# EasyEDA Pro project ProPrj_IoT Animal Trap_2026-03-28 1.epro, schematic Schematic1
Board Name: Board1; Create Date: 2026-03-20; Page Name: P1; Project Name: IoT Animal Trap; Schematic Name: Schematic1; Update Date: 2026-03-28; Company: EasyEDA.com; Page Size: A4; Version: V1.0
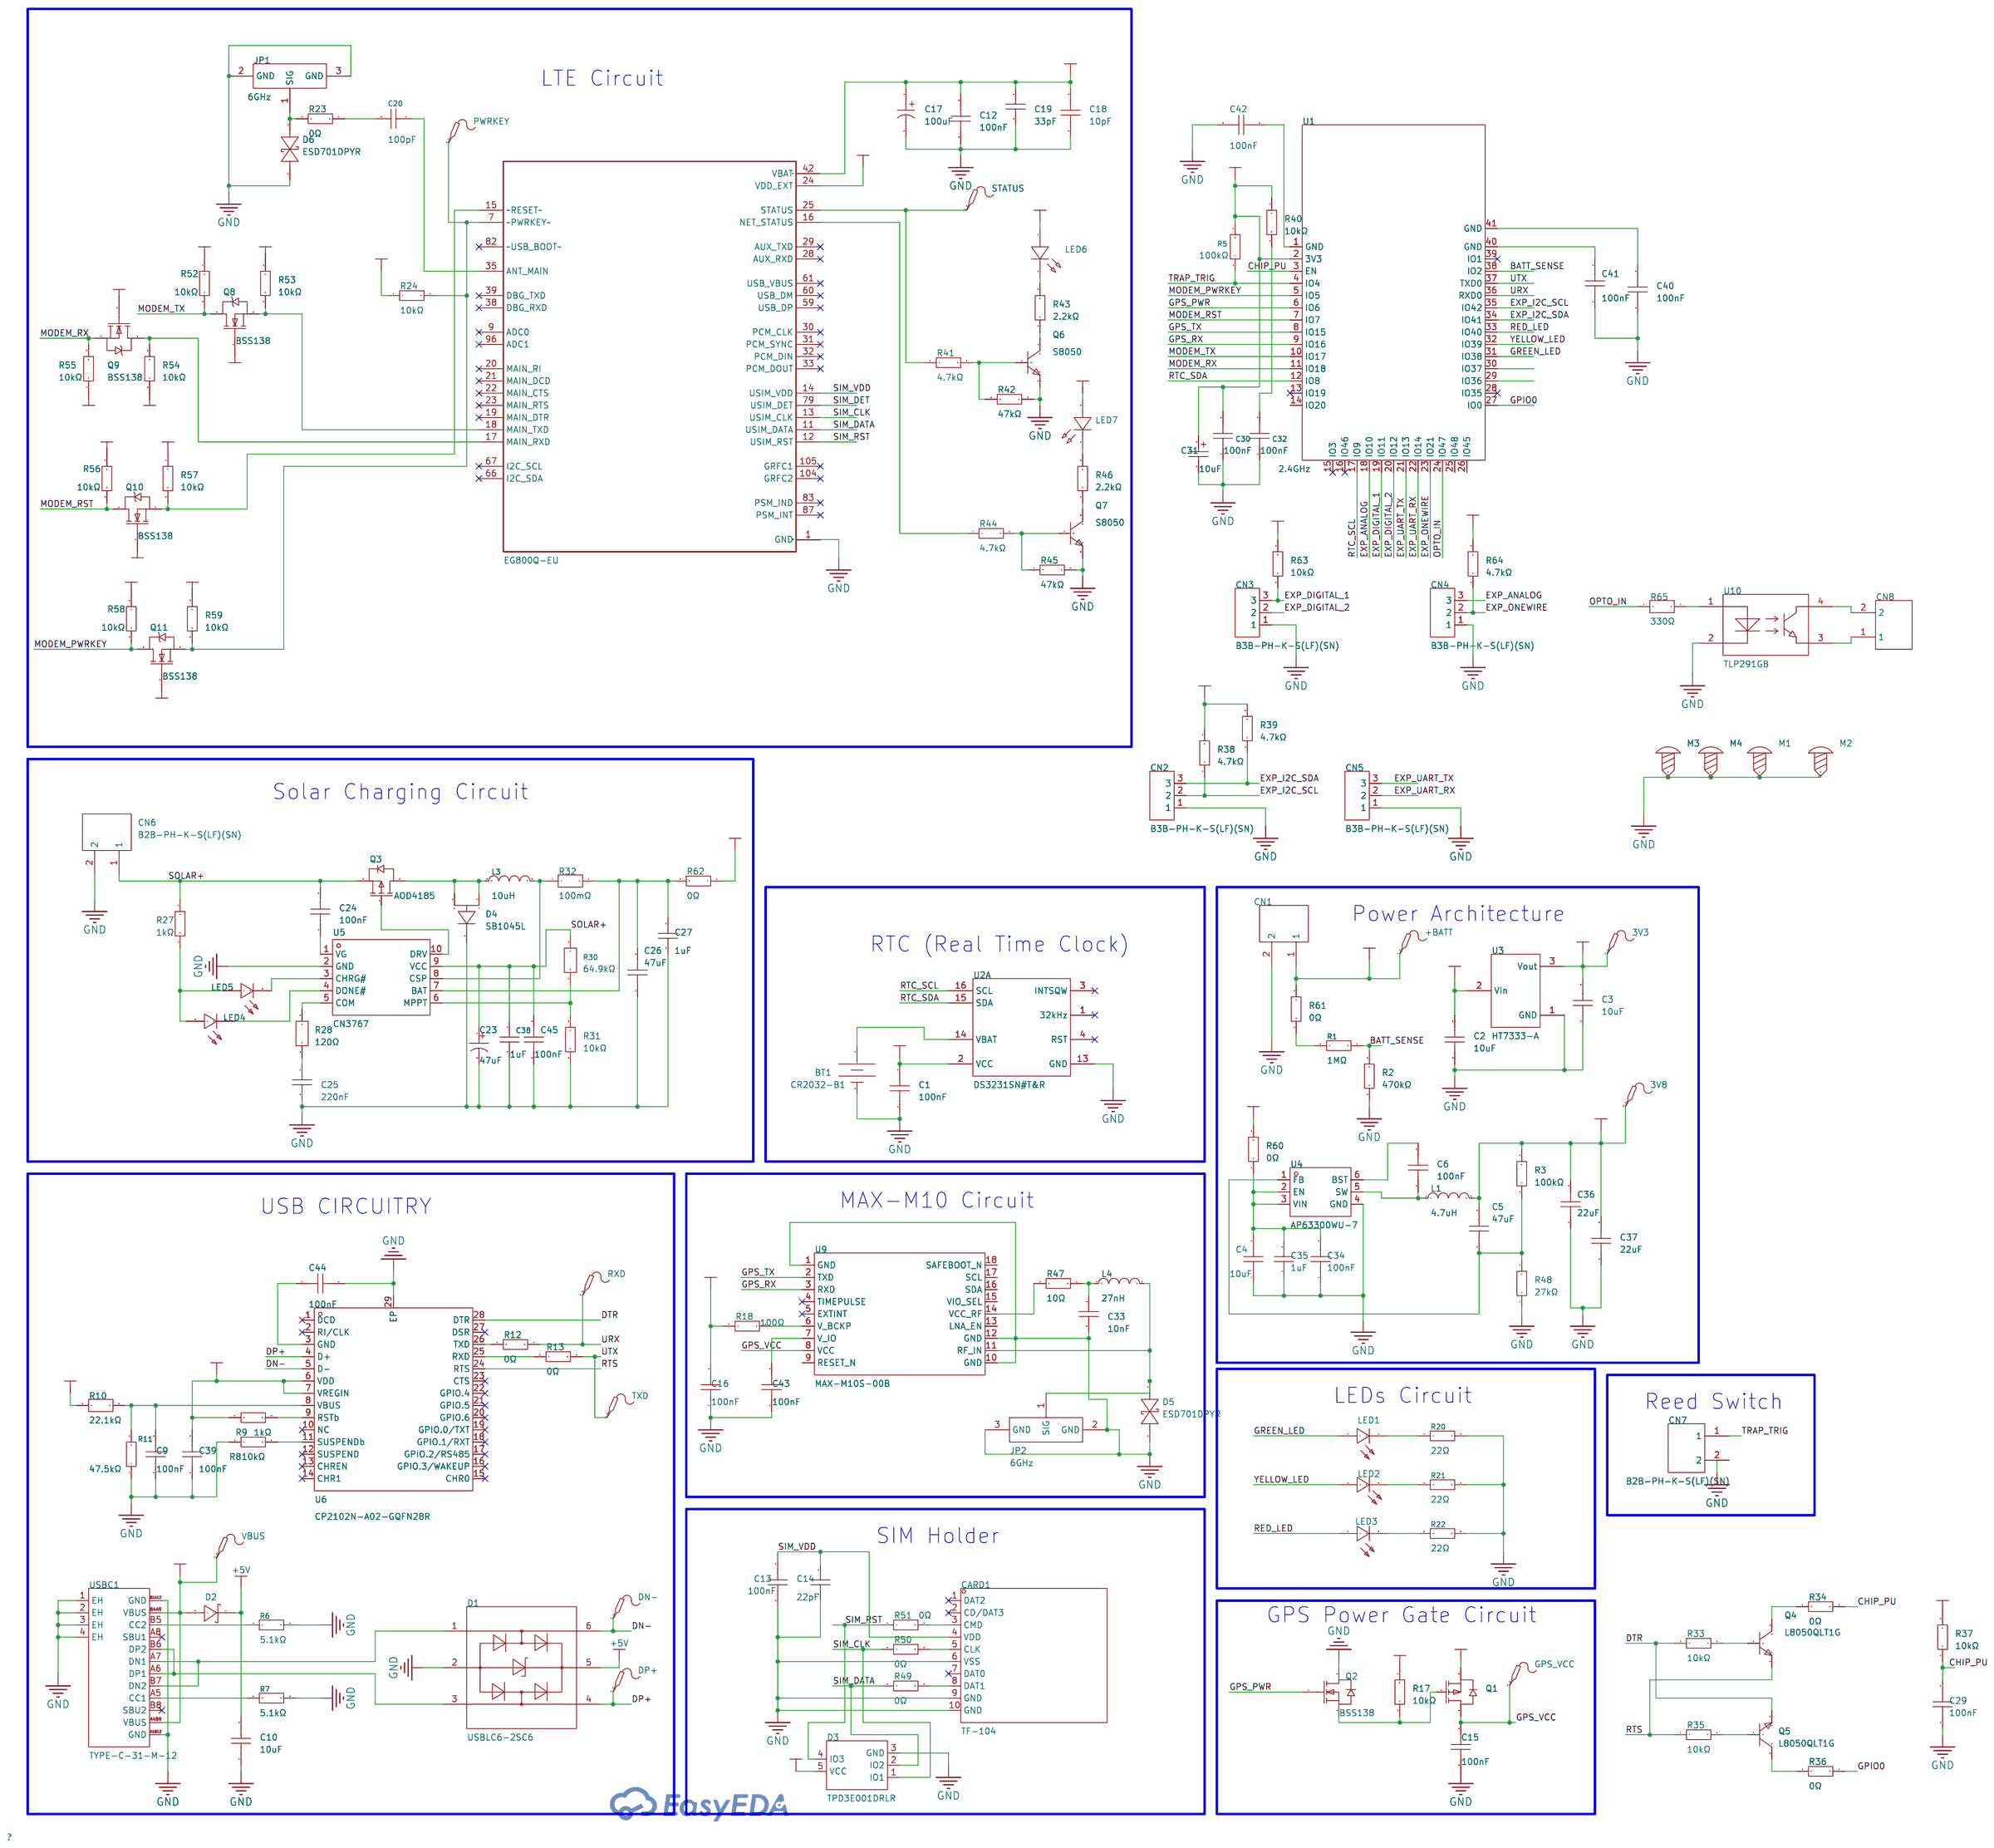
[diagram p0: schematic sheet]

## Parts
3V3  -  [Test-Point-0.5mm]
3V8  -  [Test-Point-0.5mm]
+BATT  -  [Test-Point-0.5mm]
BT1  CR2032-B1  [BAT-SMD_CR2032-B1]
C1  100nF  [C0402]
C2  10uF  [C0805]
C3  10uF  [C0805]
C4  10uF  [C0805]
C5  47uF  [C0805]
C6  100nF  [C0402]
C9  100nF  [C0402]
C10  10uF  [C0805]
C12  100nF  [C0402]
C13  100nF  [C0402]
C14  22pF  [C0402]
C15  100nF  [C0402]
C16  100nF  [C0402]
C17  100uF  [CAP-SMD_BD6.3-L6.6-W6.6-LS7.2-FD]
C18  10pF  [C0402]
C19  33pF  [C0402]
C20  100pF  [C0402]
C23  47uF  [CAP-SMD_BD6.3-L6.6-W6.6-FD]
C24  100nF  [C0402]
C25  220nF  [C0402]
C26  47uF  [C0805]
C27  1uF  [C0402]
C29  100nF  [C0402]
C30  100nF  [C0402]
C31  10uF  [CASE-B_3528]
C32  100nF  [C0402]
C33  10nF  [C0402]
C34  100nF  [C0402]
C35  1uF  [C0402]
C36  22uF  [C0402]
C37  22uF  [C0402]
C38  1uF  [C0402]
C39  100nF  [C0402]
C40  100nF  [C0402]
C41  100nF  [C0402]
C42  100nF  [C0402]
C43  100nF  [C0402]
C44  100nF  [C0402]
C45  100nF  [C0402]
CARD1  TF-104  [TF-SMD_TF-104]
CN1  B2B-PH-K-S(LF)(SN)  [CONN-TH_B2B-PH-K-S]
CN2  B3B-PH-K-S(LF)(SN)  [CONN-TH_B3B-PH-K-S]  (no BOM)
CN3  B3B-PH-K-S(LF)(SN)  [CONN-TH_B3B-PH-K-S]  (no BOM)
CN4  B3B-PH-K-S(LF)(SN)  [CONN-TH_B3B-PH-K-S]  (no BOM)
CN5  B3B-PH-K-S(LF)(SN)  [CONN-TH_B3B-PH-K-S]  (no BOM)
CN6  B2B-PH-K-S(LF)(SN)  [CONN-TH_B2B-PH-K-S]
CN7  B2B-PH-K-S(LF)(SN)  [CONN-TH_B2B-PH-K-S]  (no BOM)
CN8  B2B-PH-K-S(LF)(SN)  [CONN-TH_B2B-PH-K-S]  (no BOM)
D1  USBLC6-2SC6  [SOT-23-6_L2.9-W1.6-P0.95-LS2.8-BL]
D2  1N5819HW-7-F  [SOD-123_L2.7-W1.6-LS3.7-RD]
D3  TPD3E001DRLR  [SOT-553-5_L1.6-W1.2-P0.50-LS1.6-TL]
D4  SB1045L  [TO-277_3P-L5.4-W4.0-LS6.5-TR]
D5  ESD701DPYR  [X1SON-2_L1.0-W0.6-P0.65-BI]
D6  ESD701DPYR  [X1SON-2_L1.0-W0.6-P0.65-BI]
DN-  -  [Test-Point-0.5mm]
DP+  -  [Test-Point-0.5mm]
GPS_VCC  -  [Test-Point-0.5mm]
JP1  6GHz  [RF-SMD_FRF05002-JSS103M]
JP2  6GHz  [RF-SMD_FRF05002-JSS103M]
L1  4.7uH  [IND-SMD_L5.0-W5.0]
L3  10uH  [IND-SMD_L5.2-W5.2_MCW-0530]
L4  27nH  [L0402-RD]
LED1  19-217/GHC-YR1S2/3T  [LED0603-RD]
LED2  19-217/BHC-ZL1M2RY/3T  [LED0603-FD_BLUE]
LED3  17-21SURC/S530-A3/TR8  [LED0805-R-RD]
LED4  19-217/GHC-YR1S2/3T  [LED0603-RD]
LED5  17-21SURC/S530-A3/TR8  [LED0805-R-RD]
LED6  SML-D12P8WT86C  [LED0603-FD_GREEN]
LED7  YLED0603Y  [LED0603-RD-1]
M1  -  [Screw-Hole-M3]
M2  -  [Screw-Hole-M3]
M3  -  [Screw-Hole-M3]
M4  -  [Screw-Hole-M3]
PWRKEY  -  [Test-Point-0.5mm]
Q1  SI2301CDS-T1-GE3  [SOT-23-3_L3.0-W1.7-P0.95-LS2.9-BR]
Q2  BSS138  [SOT-23-3_L2.9-W1.3-P1.90-LS2.4-BR_1]
Q3  AOD4185  [TO-252-3_L6.6-W6.1-P4.57-LS9.9-BR-CW]
Q4  L8050QLT1G  [SOT-23-3_L2.9-W1.3-P1.90-LS2.4-BR]
Q5  L8050QLT1G  [SOT-23-3_L2.9-W1.3-P1.90-LS2.4-BR]
Q6  S8050  [SOT-23-3_L2.9-W1.3-P1.90-LS2.4-BR]
Q7  S8050  [SOT-23-3_L2.9-W1.3-P1.90-LS2.4-BR]
Q8  BSS138  [SOT-23-3_L2.9-W1.6-P1.90-LS2.8-BR]
Q9  BSS138  [SOT-23-3_L2.9-W1.6-P1.90-LS2.8-BR]
Q10  BSS138  [SOT-23-3_L2.9-W1.6-P1.90-LS2.8-BR]
Q11  BSS138  [SOT-23-3_L2.9-W1.6-P1.90-LS2.8-BR]
R1  1MΩ  [R0402]
R2  470kΩ  [R0402]
R3  100kΩ  [R0603]
R5  100kΩ  [R0402]
R6  5.1kΩ  [R0402]
R7  5.1kΩ  [R0402]
R8  10kΩ  [R0402]
R9  1kΩ  [R0402]
R10  22.1kΩ  [R0402]
R11  47.5kΩ  [R0402]
R12  0Ω  [R0402]
R13  0Ω  [R0402]
R17  10kΩ  [R0402]
R18  100Ω  [R0402]
R20  22Ω  [R0402]
R21  22Ω  [R0402]
R22  22Ω  [R0402]
R23  0Ω  [R0402]
R24  10kΩ  [R0402]
R27  1kΩ  [R0402]
R28  120Ω  [R0402]
R30  64.9kΩ  [R0402]
R31  10kΩ  [R0402]
R32  100mΩ  [R0402]
R33  10kΩ  [R0402]
R34  0Ω  [R0402]
R35  10kΩ  [R0402]
R36  0Ω  [R0402]
R37  10kΩ  [R0402]
R38  4.7kΩ  [R0402]
R39  4.7kΩ  [R0402]
R40  10kΩ  [R0402]
R41  4.7kΩ  [R0402]
R42  47kΩ  [R0402]
R43  2.2kΩ  [R0402]
R44  4.7kΩ  [R0402]
R45  47kΩ  [R0402]
R46  2.2kΩ  [R0402]
R47  10Ω  [R0402]
R48  27kΩ  [R0603]
R49  0Ω  [R0402]
R50  0Ω  [R0402]
R51  0Ω  [R0402]
R52  10kΩ  [R0402]
R53  10kΩ  [R0402]
R54  10kΩ  [R0402]
R55  10kΩ  [R0402]
R56  10kΩ  [R0402]
R57  10kΩ  [R0402]
R58  10kΩ  [R0402]
R59  10kΩ  [R0402]
R60  0Ω  [R0402]
R61  0Ω  [R0402]
R62  0Ω  [R0402]
R63  10kΩ  [R0402]
R64  4.7kΩ  [R0402]
R65  330Ω  [R0402]
RXD  -  [SMD-1_BD1.5]
STATUS  -  [Test-Point-0.5mm]
TXD  -  [SMD-1_BD1.5]
U1  2.4GHz  [WIRELM-SMD_ESP32-S3-WROOM-1]
U2  DS3231SN#T&R  [SOIC-16_L10.3-W7.5-P1.27-LS10.3-BL]  (section 1)
U3  HT7333-A  [SOT-89-3_L4.5-W2.5-P1.50-LS4.2-BR]
U4  AP63300WU-7  [TSOT-23-6_L2.9-W1.6-P0.95-LS2.8-BR]
U5  CN3767  [SSOP-10_L4.9-W3.9-P1.00-LS6.0-BL]
U6  CP2102N-A02-GQFN28R  [QFN-28_L5.0-W5.0-P0.50-TL-EP3.3]
U7  EG800Q-EU  [XCVR_EG800Q-EU]  (section 1)
U9  MAX-M10S-00B  [SMD-18_L10.1-W9.7-P1.10-TL_SKG09F]
U10  TLP291GB  [SO-4_L4.6-W2.6-P1.27-LS7.0]
USBC1  TYPE-C-31-M-12  [USB-C_SMD-TYPE-C-31-M-12_1]
VBUS  -  [Test-Point-0.5mm]

## Library data of the parts
3V3 3V8 +BATT DN- DP+ GPS_VCC PWRKEY RXD STATUS TXD VBUS = Test-Point: Test Point 测试点
BT1 = CR2032-B1: Supplier Part: F; Manufacturer: HanElectricity(瀚源); Supplier Footprint: SMD; JLCPCB Part Class: Extended Part; Datasheet: https://item.szlcsc.com/datasheet/CR2032-B1/50871509.html; Supplier: LCSC
C1 C6 C9 C12 C13 C15 C16 C24 C29 C34 C39-C45 = CL05B104KO5NNNC: Capacitance:100nF Tolerance:±10% Tolerance:±10% Voltage Rating:16V Temperature Coefficient:X7R; LCSC Part Name: 100nF ±10% 16V; Supplier Part: C1525; Manufacturer: SAMSUNG(三星); Supplier Footprint: 0402; JLCPCB Part Class: Basic Part; Datasheet: https://item.szlcsc.com/datasheet/CL05B104KO5NNNC/1877.html; Supplier: LCSC; Tolerance: ±10%; Voltage Rating: 16V; Temperature Coefficient: X7R
C2-C4 C10 = CL21A106KAYNNNE_C15850: Capacitance:10uF Tolerance:±10% Tolerance:±10% Voltage Rating:25V Temperature Coefficient:X5R; LCSC Part Name: 10uF ±10% 25V; Supplier Part: C15850; Manufacturer: SAMSUNG(三星); Manufacturer Part: CL21A106KAYNNNE; Supplier Footprint: 0805; JLCPCB Part Class: Basic Part; Datasheet: https://item.szlcsc.com/datasheet/CL21A106KAYNNNE/16532.html; Supplier: LCSC; Tolerance: ±10%; Voltage Rating: 25V; Temperature Coefficient: X5R
C5 C26 = GRM21BR61A476ME15L: Capacitance:47uF Tolerance:±20% Tolerance:±20% Voltage Rating:10V Temperature Coefficient:X5R; LCSC Part Name: 47uF ±20% 10V; Supplier Part: C124129; Manufacturer: muRata(村田); Supplier Footprint: 0805; JLCPCB Part Class: Extended Part; Datasheet: https://item.szlcsc.com/datasheet/GRM21BR61A476ME15L/125403.html; Supplier: LCSC; Tolerance: ±20%; Voltage Rating: 10V; Temperature Coefficient: X5R
C14 = 0402CG220J500NT: Capacitance:22pF Tolerance:±5% Tolerance:±5% Voltage Rating:50V Temperature Coefficient:C0G; LCSC Part Name: 22pF ±5% 50V; Supplier Part: C1555; Manufacturer: FH(风华); Supplier Footprint: 0402; JLCPCB Part Class: Basic Part; Datasheet: https://item.szlcsc.com/datasheet/0402CG220J500NT/1907.html; Supplier: LCSC; Tolerance: ±5%; Voltage Rating: 50V; Temperature Coefficient: C0G
C17 = RVT100UF16V67RV0016: Capacitance:100uF Tolerance:±20% Tolerance:±20% Voltage Rating:16V Ripple Current:93mA@120Hz Equivalent Series Resistance(ESR):- Diameter:6.3mm Height - Seated (Max):5.4mm Lifetime:2000hrs@105℃ Operating Temperature:-55℃~+105℃ Operating Temperature:-55℃~+; LCSC Part Name: 100uF ±20% 16V; Supplier Part: C2887276; Manufacturer: KNSCHA(科尼盛); Supplier Footprint: SMD,D6.3xL5.4mm; JLCPCB Part Class: Extended Part; Datasheet: https://item.szlcsc.com/datasheet/RVT100UF16V67RV0016/3103844.html; Supplier: LCSC; Tolerance: ±20%; Voltage Rating: 16V; Ripple Current: 93mA@120Hz; Diameter: 6.3mm; Height - Seated (Max): 5.4mm; Lifetime: 2000hrs@105℃; Operating Temperature: -55℃~+105℃
C18 = CL05C100JB5NNNC: Capacitance:10pF Tolerance:±5% Tolerance:±5% Voltage Rating:50V Temperature Coefficient:C0G; LCSC Part Name: 10pF ±5% 50V; Supplier Part: C32949; Manufacturer: SAMSUNG(三星); Supplier Footprint: 0402; JLCPCB Part Class: Basic Part; Datasheet: https://item.szlcsc.com/datasheet/CL05C100JB5NNNC/33914.html; Supplier: LCSC; Tolerance: ±5%; Voltage Rating: 50V; Temperature Coefficient: C0G
C19 = CL05C330JB5NNNC: Capacitance:33pF Tolerance:±5% Tolerance:±5% Voltage Rating:50V Temperature Coefficient:C0G; LCSC Part Name: 33pF ±5% 50V; Supplier Part: C70465; Manufacturer: SAMSUNG(三星); Supplier Footprint: 0402; JLCPCB Part Class: Extended Part; Datasheet: https://item.szlcsc.com/datasheet/CL05C330JB5NNNC/71562.html; Supplier: LCSC; Tolerance: ±5%; Voltage Rating: 50V; Temperature Coefficient: C0G
C20 = CC0402JRNPO9BN101: Capacitance:100pF Tolerance:±5% Tolerance:±5% Voltage Rating:50V Temperature Coefficient:NP0; LCSC Part Name: 100pF ±5% 50V; Supplier Part: C106200; Manufacturer: YAGEO(国巨); Supplier Footprint: 0402; JLCPCB Part Class: Extended Part; Datasheet: https://item.szlcsc.com/datasheet/CC0402JRNPO9BN101/107415.html; Supplier: LCSC; Tolerance: ±5%; Voltage Rating: 50V; Temperature Coefficient: NP0
C23 = RVT1V470M0605_C72522: Capacitance:47uF Tolerance:±20% Tolerance:±20% Voltage Rating:35V Ripple Current:54mA@120Hz Equivalent Series Resistance(ESR):- Diameter:6.3mm Height - Seated (Max):5.4mm Lifetime:2000hrs@105℃ Operating Temperature:-40℃~+105℃ Operating Temperature:-40℃~+1; LCSC Part Name: 47uF ±20% 35V; Supplier Part: C72522; Manufacturer: ROQANG(容强); Manufacturer Part: RVT1V470M0605; Supplier Footprint: SMD,D6.3xL5.4mm; JLCPCB Part Class: Extended Part; Datasheet: https://item.szlcsc.com/datasheet/RVT1V470M0605/73633.html; Supplier: LCSC; Tolerance: ±20%; Voltage Rating: 35V; Ripple Current: 54mA@120Hz; Diameter: 6.3mm; Height - Seated (Max): 5.4mm; Lifetime: 2000hrs@105℃; Operating Temperature: -40℃~+105℃
C25 = CL05B224KO5NNNC: Capacitance:220nF Tolerance:±10% Tolerance:±10% Voltage Rating:16V Temperature Coefficient:X7R; LCSC Part Name: 220nF ±10% 16V; Supplier Part: C16772; Manufacturer: SAMSUNG(三星); Supplier Footprint: 0402; JLCPCB Part Class: Basic Part; Datasheet: https://item.szlcsc.com/datasheet/CL05B224KO5NNNC/17456.html; Supplier: LCSC; Tolerance: ±10%; Voltage Rating: 16V; Temperature Coefficient: X7R
C27 C35 = CL05A105KP5NNNC: Capacitance:1uF Tolerance:±10% Tolerance:±10% Voltage Rating:10V Temperature Coefficient:X5R; LCSC Part Name: f; Supplier Part: C14445; Manufacturer: SAMSUNG(三星); Supplier Footprint: 0402; JLCPCB Part Class: Extended Part; Datasheet: https://item.szlcsc.com/datasheet/CL05A105KP5NNNC/15107.html; Supplier: LCSC; Tolerance: ±10%; Voltage Rating: 10V; Temperature Coefficient: X5R
C30 C32 = GRM155R71H104KE14D: Capacitance:100nF Tolerance:±10% Tolerance:±10% Voltage Rating:50V Temperature Coefficient:X7R; LCSC Part Name: 100nF ±10% 50V; Supplier Part: C77020; Manufacturer: muRata(村田); Supplier Footprint: 0402; JLCPCB Part Class: Extended Part; Datasheet: https://item.szlcsc.com/datasheet/GRM155R71H104KE14D/78147.html; Supplier: LCSC; Tolerance: ±10%; Voltage Rating: 50V; Temperature Coefficient: X7R
C31 = CA45-B-25V-10uF-K: Capacitance:10uF Tolerance:±10% Tolerance:±10% Voltage Rating:25V Equivalent Series Resistance(ESR):6Ω@100kHz Operating Temperature:-55℃~+125℃ Operating Temperature:-55℃~+125℃; LCSC Part Name: 10uF ±10% 25V; Supplier Part: C128259; Manufacturer: CEC(振华新云); Supplier Footprint: CASE-B-3528-19(mm); JLCPCB Part Class: Extended Part; Datasheet: https://item.szlcsc.com/datasheet/CA45-B-25V-10uF-K/139544.html; Supplier: LCSC; Tolerance: ±10%; Voltage Rating: 25V; Equivalent Series Resistance(ESR): 6Ω@100kHz; Operating Temperature: -55℃~+125℃
C33 = CL05B103KB5NNNC: Capacitance:10nF Tolerance:±10% Tolerance:±10% Voltage Rating:50V Temperature Coefficient:X7R; LCSC Part Name: 10nF ±10% 50V; Supplier Part: C15195; Manufacturer: SAMSUNG(三星); Supplier Footprint: 0402; JLCPCB Part Class: Basic Part; Datasheet: https://item.szlcsc.com/datasheet/CL05B103KB5NNNC/15869.html; Supplier: LCSC; Tolerance: ±10%; Voltage Rating: 50V; Temperature Coefficient: X7R
C36 C37 = GRM158R61A226ME15D: Capacitance: Tolerance:±20% Tolerance:±20% Voltage Rated: Temperature Coefficient:; LCSC Part Name: 22uF ±20% 10V; Supplier Part: C3845593; Manufacturer: muRata(村田); Supplier Footprint: 0402; JLCPCB Part Class: Extended Part; Datasheet: https://atta.szlcsc.com/upload/public/pdf/source/20230811/016E9304DA64D47AB1EFBD6C89B0D146.pdf; Supplier: LCSC; Tolerance: ±20%
C38 = CL05A105KO5NNNC: Capacitance:1uF Tolerance:±10% Tolerance:±10% Voltage Rating:16V Temperature Coefficient:X5R; LCSC Part Name: 1uF ±10% 16V; Supplier Part: C29266; Manufacturer: SAMSUNG(三星); Supplier Footprint: 0402; JLCPCB Part Class: Extended Part; Datasheet: https://item.szlcsc.com/datasheet/CL05A105KO5NNNC/30018.html; Supplier: LCSC; Tolerance: ±10%; Voltage Rating: 16V; Temperature Coefficient: X5R
CARD1 = TF-104: Card Connection Mode:Push-Pull Card Type:MicroSD Card (TF Card) Connector Type:Connector and Ejector Additional Card Detection Pins:- Supplementary Features:- Height Above Board:1.93mm Operating Temperature:-25℃~+85℃ Operating Temperature:-25℃~+85℃; LCSC Part Name: 拔插式 MicroSD卡(TF卡) 卡座; Supplier Part: C266612; Manufacturer: XUNPU(讯普); Supplier Footprint: SMD; JLCPCB Part Class: Extended Part; Datasheet: https://item.szlcsc.com/datasheet/TF-104/256967.html; Supplier: LCSC; Card Connection Mode: Push-Pull; Card Type: MicroSD Card (TF Card); Connector Type: Connector and Ejector; Height Above Board: 1.93mm; Operating Temperature: -25℃~+85℃
CN1 CN6-CN8 = B2B-PH-K-S(LF)(SN): Pins Structure:1x2P Pitch:2mm Mounting Type:Through Hole Reference Series:PH Number of Pins:2P Number of Rows:1 Number of PINs Per Row:2 Row Spacing:- Current Rating:2A Contact Material:Brass Contact Plating:Tin Operating Temperature:-25℃~+85℃ Operating T; LCSC Part Name: 1x2P 间距:2mm 直插 系列:PH; Supplier Part: C131337; Manufacturer: JST; Supplier Footprint: 插件,P=2mm; JLCPCB Part Class: Extended Part; Datasheet: https://item.szlcsc.com/datasheet/B2B-PH-K-S(LF)(SN)/142630.html; Supplier: LCSC; Pins Structure: 1x2P; Pitch: 2mm; Mounting Type: Through Hole; Reference Series: PH; Number of Pins: 2P; Number of Rows: 1; Number of PINs Per Row: 2; Current Rating: 2A; Contact Material: Brass; Contact Plating: Tin; Operating Temperature: -25℃~+85℃; Voltage Rating: 100V; Plastic Material: PA66; Flame Retardant Rating: UL94V-0; Supplementary Features: K Pin; Color: White; Z-Height of the Board: 6mm; X-Length of Bottom Edge on Board (Spacing Line): 5.9mm; Y-Width of Bottom Edge on Board: 4.5mm
CN2-CN5 = B3B-PH-K-S(LF)(SN): Pins Structure:1x3P Pitch:2mm Mounting Type:Through Hole Reference Series:PH Number of Pins:3P Number of Rows:1 Number of PINs Per Row:3 Row Spacing:- Current Rating:2A Contact Material:Brass Contact Plating:Tin Operating Temperature:-25℃~+85℃ Operating T; LCSC Part Name: 1x3P 间距:2mm 直插 系列:PH; Supplier Part: C131339; Manufacturer: JST; Supplier Footprint: 插件,P=2mm; JLCPCB Part Class: Extended Part; Datasheet: https://item.szlcsc.com/datasheet/B3B-PH-K-S(LF)(SN)/142632.html; Supplier: LCSC; Pins Structure: 1x3P; Pitch: 2mm; Mounting Type: Through Hole; Reference Series: PH; Number of Pins: 3P; Number of Rows: 1; Number of PINs Per Row: 3; Current Rating: 2A; Contact Material: Brass; Contact Plating: Tin; Operating Temperature: -25℃~+85℃; Voltage Rating: 100V; Plastic Material: PA66; Flame Retardant Rating: UL94V-0; Supplementary Features: K Pin; Color: White; Z-Height of the Board: 6mm; X-Length of Bottom Edge on Board (Spacing Line): 7.9mm; Y-Width of Bottom Edge on Board: 4.5mm
D1 = USBLC6-2SC6_C7519: Polarity:Unidirectional Reverse Stand-Off Voltage (Vrwm):5.25V Clamping Voltage:17V Peak Pulse Current (Ipp):5A Voltage - Breakdown:6V Reverse Leakage Current (Ir):150nA Number of Channels:2 Operating Temperature:-40℃~+125℃ Operating Temperature:-40℃~+125; LCSC Part Name: 单向ESD; Supplier Part: C7519; Manufacturer: ST(意法半导体); Supplier Footprint: SOT-23-6L; JLCPCB Part Class: Extended Part; Datasheet: https://item.szlcsc.com/datasheet/USBLC6-2SC6/7996.html; Supplier: LCSC; Polarity: Unidirectional; Reverse Stand-Off Voltage (Vrwm): 5.25V; Clamping Voltage: 17V; Peak Pulse Current (Ipp): 5A; Voltage - Breakdown: 6V; Reverse Leakage Current (Ir): 150nA; Number of Channels: 2; Operating Temperature: -40℃~+125℃; level of protection: IEC 61000-4-2; Type: ESD; Junction Capacitance: 3.5pF
D2 = 1N5819HW-7-F: Diode Configuration:1 Independent Voltage - Forward(Vf@If):450mV@1A Voltage - DC Reverse(Vr):40V Current - Rectified:1A Reverse Leakage Current (Ir):1mA@40V Operating Junction Temperature Range:-65℃~+150℃ Operating Junction Temperature Range:-65℃~+150℃ No; LCSC Part Name: 电压:40V 电流:1A; Supplier Part: C82544; Manufacturer: DIODES(美台); Supplier Footprint: SOD-123; JLCPCB Part Class: Extended Part; Datasheet: https://item.szlcsc.com/datasheet/1N5819HW-7-F/83701.html; Supplier: LCSC; Diode Configuration: 1 Independent; Voltage - Forward(Vf@If): 450mV@1A; Voltage - DC Reverse(Vr): 40V; Current - Rectified: 1A; Reverse Leakage Current (Ir): 1mA@40V; Operating Junction Temperature Range: -65℃~+150℃; Non-Repetitive Peak Forward Surge Current: 25A
D3 = TPD3E001DRLR: Polarity:Unidirectional Reverse Stand-Off Voltage (Vrwm):5.5V Peak Pulse Current (Ipp):5.5A@8/20us Peak Pulse Power Dissipation (Ppp):90W Voltage - Breakdown:11V Reverse Leakage Current (Ir):1nA Number of Channels:three routes Operating Temperature:-40℃~+; LCSC Part Name: 单向 5.5V 5.5A@8/20us; Supplier Part: C470828; Manufacturer: TI(德州仪器); Supplier Footprint: SOT(5x3); JLCPCB Part Class: Extended Part; Datasheet: https://www.ti.com/cn/lit/gpn/tpd3e001; Supplier: LCSC; Polarity: Unidirectional; Reverse Stand-Off Voltage (Vrwm): 5.5V; Peak Pulse Current (Ipp): 5.5A@8/20us; Peak Pulse Power Dissipation (Ppp): 90W; Voltage - Breakdown: 11V; Reverse Leakage Current (Ir): 1nA; Number of Channels: three routes; Operating Temperature: -40℃~+85℃; level of protection: IEC 61000-4-2; Type: ESD; Junction Capacitance: 1.5pF
D4 = SB1045L_C908747: Diode Configuration:Independent Voltage - Forward(Vf@If):530mV@10A Voltage - DC Reverse(Vr):45V Current - Rectified:10A Reverse Leakage Current (Ir):150uA Non-Repetitive Peak Forward Surge Current:150A; LCSC Part Name: 电压:45V 电流:10A; Supplier Part: C908747; Manufacturer: GOODWORK(固得沃克); Supplier Footprint: TO-277; JLCPCB Part Class: Extended Part; Datasheet: https://item.szlcsc.com/datasheet/SB1045L/975499.html; Supplier: LCSC; Diode Configuration: Independent; Voltage - Forward(Vf@If): 530mV@10A; Voltage - DC Reverse(Vr): 45V; Current - Rectified: 10A; Reverse Leakage Current (Ir): 150uA; Non-Repetitive Peak Forward Surge Current: 150A
D5 D6 = ESD701DPYR: Supplier Part: C42409125; Manufacturer: TI(德州仪器); Supplier Footprint: X1SON-2(0.6x1); JLCPCB Part Class: Extended Part; Supplier: LCSC
JP1 JP2 = U.FL-R-SMT-1(80)_C88374: Connector Type:Board Side Interface:Male Pin Number of Ports:1 Interface Diameter:2mm Interface Length/Height:1.25mm Frequency:6GHz RF Series:IPEX Impedance:50Ω Style:- Operating Temperature Range:-40℃~+90℃ Operating Temperature Range:-40℃~+90℃; LCSC Part Name: IPEX 内针; Supplier Part: C88374; Manufacturer: HRS(广濑); Manufacturer Part: U.FL-R-SMT-1(80); Supplier Footprint: SMD; JLCPCB Part Class: Extended Part; Datasheet: https://item.szlcsc.com/datasheet/U.FL-R-SMT-1(80)/89553.html; Supplier: LCSC; Connector Type: Board Side; Interface: Male Pin; Number of Ports: 1; Interface Diameter: 2mm; Interface Length/Height: 1.25mm; RF Series: IPEX; Impedance: 50Ω; Operating Temperature Range: -40℃~+90℃
L1 = CKCS5040-4.7uH/M: Inductance:4.7uH Tolerance:±20% Tolerance:±20% Current Rating:3A Current - Saturation(Isat):3.5A DC Resistance(DCR):32mΩ Type:Magnetic Shielded Inductor; LCSC Part Name: 4.7uH ±20%; Supplier Part: C354606; Manufacturer: CENKER(岑科); Supplier Footprint: SMD,5x5mm; JLCPCB Part Class: Extended Part; Datasheet: https://item.szlcsc.com/datasheet/CKCS5040-4.7uH%252FM/330231.html; Supplier: LCSC; Tolerance: ±20%; Current Rating: 3A; Current - Saturation(Isat): 3.5A; DC Resistance(DCR): 32mΩ; Type: Magnetic Shielded Inductor
L3 = SMMS0530-100M: Inductance:10uH Tolerance:±20% Tolerance:±20% Current Rating:3.2A Current - Saturation(Isat):3.5A DC Resistance(DCR):125mΩ Type:-; LCSC Part Name: 10uH ±20% 3.5A; Supplier Part: C181721; Manufacturer: SXN(顺翔诺); Supplier Footprint: SMD,5.5x5.2mm; JLCPCB Part Class: Extended Part; Datasheet: https://item.szlcsc.com/datasheet/SMMS0530-100M/193118.html; Supplier: LCSC; Tolerance: ±20%; Current Rating: 3.2A; Current - Saturation(Isat): 3.5A; DC Resistance(DCR): 125mΩ
L4 = LQG15HS27NJ02D: Inductance:27nH Tolerance:±5% Tolerance:±5% Current Rating:350mA Current - Saturation (Isat):- DC Resistance(DCR):460mΩ Q @ Frequency:8@100MHz Frequency - Self Resonant:1.7GHz Ratings:-; LCSC Part Name: 27nH ±5%; Supplier Part: C12669; Manufacturer: muRata(村田); Supplier Footprint: 0402; JLCPCB Part Class: Extended Part; Datasheet: https://item.szlcsc.com/datasheet/LQG15HS27NJ02D/13305.html; Supplier: LCSC; Tolerance: ±5%; Current Rating: 350mA; DC Resistance(DCR): 460mΩ; Q @ Frequency: 8@100MHz; Frequency - Self Resonant: 1.7GHz
LED1 LED4 = 19-217/GHC-YR1S2/3T: Lamp Holder Type:- Illumination Color:Emerald Green Voltage - Forward(Vf):3.3V Voltage - Forward(Vf):3.3V Power(Watts):110mW Forward Current:20mA Wavelength - Dominant:520nm~535nm Wavelength - Dominant:520nm~535nm Peak Wavelength:518nm Diode Configuration; LCSC Part Name: 翠绿 停产; Supplier Part: C72043; Manufacturer: EVERLIGHT(亿光); Supplier Footprint: 0603; JLCPCB Part Class: Extended Part; Supplier: LCSC; Illumination Color: Emerald Green; Voltage - Forward(Vf): 3.3V; Power(Watts): 110mW; Forward Current: 20mA; Wavelength - Dominant: 520nm~535nm; Peak Wavelength: 518nm; Diode Configuration: Discrete Diode; Lens Color: Water Clear; Luminous Intensity: 199mcd; Viewing Angle: 120°; Operating Temperature: -40℃~+85℃
LED2 = 19-217/BHC-ZL1M2RY/3T: Lamp Holder Type:- Illumination Color:Blue Voltage - Forward(Vf):2.8V Voltage - Forward(Vf):2.8V Power(Watts):110mW Forward Current:5mA Wavelength - Dominant:465nm~475nm Wavelength - Dominant:465nm~475nm Peak Wavelength:468nm Diode Configuration:Discrete; LCSC Part Name: 蓝灯 停产; Supplier Part: C72041; Manufacturer: EVERLIGHT(亿光); Supplier Footprint: 0603; JLCPCB Part Class: Extended Part; Datasheet: https://en.everlight.com/wp-content/plugins/ItemRelationship/product_files/pdf/19-217-BHC-ZL1M2RY-3T.pdf; Supplier: LCSC; Illumination Color: Blue; Voltage - Forward(Vf): 2.8V; Power(Watts): 110mW; Forward Current: 5mA; Wavelength - Dominant: 465nm~475nm; Peak Wavelength: 468nm; Diode Configuration: Discrete Diode; Lens Color: Water Clear; Luminous Intensity: 24.5mcd~28.5mcd; Viewing Angle: 120°; Operating Temperature: -40℃~+85℃
LED3 = 17-21SURC/S530-A3/TR8: Lamp Holder Type:- Illumination Color:Orange Red Voltage - Forward(Vf):2V Voltage - Forward(Vf):2V Power(Watts):60mW Forward Current:20mA Wavelength - Dominant:624nm Wavelength - Dominant:624nm Peak Wavelength:632nm Diode Configuration:- Lens Color:Water; LCSC Part Name: 17-21SURC/S530-A3/TR8 停产; Supplier Part: C72037; Manufacturer: EVERLIGHT(亿光); Supplier Footprint: 0805; JLCPCB Part Class: Extended Part; Supplier: LCSC; Illumination Color: Orange Red; Voltage - Forward(Vf): 2V; Power(Watts): 60mW; Forward Current: 20mA; Wavelength - Dominant: 624nm; Peak Wavelength: 632nm; Lens Color: Water Clear; Luminous Intensity: 41mcd~61mcd; Viewing Angle: 140°; Operating Temperature: -40℃~+85℃
LED5 = 17-21SURC/S530-A3/TR8: Lamp Holder Type:- Illumination Color:Orange Red Voltage - Forward(Vf):2V Voltage - Forward(Vf):2V Power(Watts):60mW Forward Current:20mA Wavelength - Dominant:624nm Wavelength - Dominant:624nm Peak Wavelength:632nm Diode Configuration:- Lens Color:Water; LCSC Part Name: 17-21SURC/S530-A3/TR8 停产; Supplier Part: f; Manufacturer: EVERLIGHT(亿光); Supplier Footprint: 0805; JLCPCB Part Class: Extended Part; Supplier: LCSC; Illumination Color: Orange Red; Voltage - Forward(Vf): 2V; Power(Watts): 60mW; Forward Current: 20mA; Wavelength - Dominant: 624nm; Peak Wavelength: 632nm; Lens Color: Water Clear; Luminous Intensity: 41mcd~61mcd; Viewing Angle: 140°; Operating Temperature: -40℃~+85℃
LED6 = SML-D12P8WT86C: Lamp Holder Type:- Illumination Color:Green Voltage - Forward(Vf):2.2V Voltage - Forward(Vf):2.2V Power(Watts):- Forward Current:20mA Wavelength - Dominant:560nm Wavelength - Dominant:560nm Peak Wavelength:- Diode Configuration:Discrete Diode Lens Color:W; LCSC Part Name: 普绿/黄绿; Supplier Part: C2909774; Manufacturer: ROHM(罗姆); Supplier Footprint: 0603; JLCPCB Part Class: Extended Part; Datasheet: https://item.szlcsc.com/datasheet/SML-D12P8WT86C/3188162.html; Supplier: LCSC; Illumination Color: Green; Voltage - Forward(Vf): 2.2V; Forward Current: 20mA; Wavelength - Dominant: 560nm; Diode Configuration: Discrete Diode; Lens Color: White Lens; Luminous Intensity: 6.3mcd
LED7 = YLED0603Y: Lamp Holder Type:- Illumination Color:Yellow Voltage - Forward(Vf):1.8V~2.4V Voltage - Forward(Vf):1.8V~2.4V Power(Watts):- Forward Current:30mA Wavelength - Dominant:585nm~595nm Wavelength - Dominant:585nm~595nm Peak Wavelength:- Diode Configuration:Disc; LCSC Part Name: 黄色 独立二极管; Supplier Part: C19273152; Manufacturer: YONGYUTAI(永裕泰); Supplier Footprint: 0603; JLCPCB Part Class: Extended Part; Datasheet: https://item.szlcsc.com/datasheet/YLED0603Y/20555406.html; Supplier: LCSC; Illumination Color: Yellow; Voltage - Forward(Vf): 1.8V~2.4V; Forward Current: 30mA; Wavelength - Dominant: 585nm~595nm; Diode Configuration: Discrete Diode; Luminous Intensity: 144mcd; Viewing Angle: 120°; Operating Temperature: -40℃~+85℃
M1-M4 = Screw-Hole-M3: Supplier Footprint: 插件
Q1 = SI2301CDS-T1-GE3: Number:1 P-Channel Drain to Source Voltage:20V Current - Continuous Drain(Id):3.1A RDS(on):142mΩ@2.5V,2.7A Pd - Power Dissipation:1.6W Gate Threshold Voltage (Vgs(th)):1V@250uA Gate Charge(Qg):10nC@4.5V Input Capacitance(Ciss):405pF Reverse Transfer Capac; LCSC Part Name: 1个P沟道 耐压:20V 电流:3.1A; Supplier Part: C10487; Manufacturer: VISHAY(威世); Supplier Footprint: SOT-23; JLCPCB Part Class: Basic Part; Datasheet: https://item.szlcsc.com/datasheet/SI2301CDS-T1-GE3/11030.html; Supplier: LCSC; Number: 1 P-Channel; Drain to Source Voltage: 20V; Current - Continuous Drain(Id): 3.1A; RDS(on): 142mΩ@2.5V,2.7A; Pd - Power Dissipation: 1.6W; Gate Threshold Voltage (Vgs(th)): 1V@250uA; Gate Charge(Qg): 10nC@4.5V; Input Capacitance(Ciss): 405pF; Reverse Transfer Capacitance (Crss@Vds): 55pF; Operating Temperature: -55℃~+150℃; Type: P-Channel; Output Capacitance(Coss): 75pF
Q2 = BSS138_C51898309: Supplier Part: C51898309; Manufacturer: baocheng(宝乘); Supplier Footprint: SOT-23; JLCPCB Part Class: Extended Part; Datasheet: https://item.szlcsc.com/datasheet/BSS138/54583734.html; Supplier: LCSC
Q3 = AOD4185_C400894: Type:1 Piece P-Channel Drain Source Voltage (Vdss): Continuous Drain Current (Id): Drain Source On Resistance (RDS(on)@Vgs,Id):20mΩ@4.5V,15A Power Dissipation (Pd): Gate Threshold Voltage (Vgs(th)@Id):1.7V@250uA Total Gate Charge (Qg@Vgs):42nC@10V Input C; LCSC Part Name: 1个P沟道 耐压:40V 电流:40A; Supplier Part: C400894; Manufacturer: AOS; Supplier Footprint: TO-252(DPAK); JLCPCB Part Class: Extended Part; Datasheet: https://atta.szlcsc.com/upload/public/pdf/source/20190627/C400894_921958B6CB7B7C674397E60AAED89785.pdf; Supplier: LCSC; Type: 1 Piece P-Channel; Drain Source On Resistance (RDS(on)@Vgs,Id): 20mΩ@4.5V,15A; Gate Threshold Voltage (Vgs(th)@Id): 1.7V@250uA; Total Gate Charge (Qg@Vgs): 42nC@10V; Input Capacitance (Ciss@Vds): 2.55nF@20V; Reverse Transfer Capacitance (Crss@Vds): 190pF@20V; Operating Temperature: -55℃~+175℃
Q4 Q5 = L8050QLT1G: type:NPN Current - Collector(Ic):800mA Collector - Emitter Voltage VCEO:25V Pd - Power Dissipation:225mW DC Current Gain:100@100mA,1V DC Current Gain:100@100mA,1V Current - Collector Cutoff:150nA Vce Saturation(VCE(sat)):500mV Operating Temperature:-55℃~+; LCSC Part Name: NPN 电流:800mA 电压:25V; Supplier Part: C49581; Manufacturer: LRC(乐山无线电); Supplier Footprint: SOT-23; JLCPCB Part Class: Extended Part; Datasheet: https://item.szlcsc.com/datasheet/L8050QLT1G/50589.html; Supplier: LCSC; type: NPN; Current - Collector(Ic): 800mA; Collector - Emitter Voltage VCEO: 25V; Pd - Power Dissipation: 225mW; DC Current Gain: 100@100mA,1V; Current - Collector Cutoff: 150nA; Vce Saturation(VCE(sat)): 500mV; Operating Temperature: -55℃~+150℃; Emitter-Base Voltage(Vebo): 5V
Q6 Q7 = S8050_C916390: type:- Current - Collector(Ic):500mA Collector - Emitter Voltage VCEO:25V Pd - Power Dissipation:300mW Transition frequency(fT):150MHz Current - Collector Cutoff:100nA Vce Saturation(VCE(sat)):600mV Operating Temperature:- Operating Temperature:- Emitter-; LCSC Part Name: 电流:500mA 电压:25V; Supplier Part: C916390; Manufacturer: JSMSEMI(杰盛微); Supplier Footprint: SOT-23; JLCPCB Part Class: Extended Part; Datasheet: https://item.szlcsc.com/datasheet/S8050/990886.html; Supplier: LCSC; Current - Collector(Ic): 500mA; Collector - Emitter Voltage VCEO: 25V; Pd - Power Dissipation: 300mW; Transition frequency(fT): 150MHz; Current - Collector Cutoff: 100nA; Vce Saturation(VCE(sat)): 600mV; Emitter-Base Voltage(Vebo): 5V; Number: 1 NPN; Configuration: Independent
Q8-Q11 = BSS138_C52895: Type:1 N-Channel Drain Source Voltage (Vdss): Continuous Drain Current (Id):220mA Drain Source On Resistance (RDS(on)@Vgs,Id):3.5Ω@10V,0.22A Power Dissipation (Pd):360mW Gate Threshold Voltage (Vgs(th)@Id):1.5V@1mA Total Gate Charge (Qg@Vgs):2.4nC@25V Inp; LCSC Part Name: 1个N沟道 耐压:50V 电流:220mA; Supplier Part: C52895; Manufacturer: onsemi(安森美); Supplier Footprint: SOT-23; JLCPCB Part Class: Extended Part; Datasheet: https://atta.szlcsc.com/upload/public/pdf/source/20170412/1491969107299.pdf; Supplier: LCSC; Type: 1 N-Channel; Continuous Drain Current (Id): 220mA; Drain Source On Resistance (RDS(on)@Vgs,Id): 3.5Ω@10V,0.22A; Power Dissipation (Pd): 360mW; Gate Threshold Voltage (Vgs(th)@Id): 1.5V@1mA; Total Gate Charge (Qg@Vgs): 2.4nC@25V; Input Capacitance (Ciss@Vds): 27pF@25V; Reverse Transfer Capacitance (Crss@Vds): 6pF; Operating Temperature: -55℃~+150℃
R1 = 0402WGF1004TCE: Type:Thick Film Resistor Resistance:1MΩ Tolerance:±1% Tolerance:±1% Power(Watts):62.5mW Voltage-Supply(Max):50V Temperature Coefficient:±100ppm/℃ Temperature Coefficient:±100ppm/℃ Operating Temperature:-55℃~+155℃ Operating Temperature:-55℃~+155℃; LCSC Part Name: 1MΩ ±1% 62.5mW 厚膜电阻; Supplier Part: C26083; Manufacturer: UNI-ROYAL(厚声); Supplier Footprint: 0402; JLCPCB Part Class: Basic Part; Datasheet: https://item.szlcsc.com/datasheet/0402WGF1004TCE/26826.html; Supplier: LCSC; Type: Thick Film Resistor; Tolerance: ±1%; Power(Watts): 62.5mW; Voltage-Supply(Max): 50V; Temperature Coefficient: ±100ppm/℃; Operating Temperature: -55℃~+155℃
R2 = 0402WGF4703TCE: Type:Thick Film Resistor Resistance:470kΩ Tolerance:±1% Tolerance:±1% Power(Watts):62.5mW Voltage-Supply(Max):50V Temperature Coefficient:±100ppm/℃ Temperature Coefficient:±100ppm/℃ Operating Temperature:-55℃~+155℃ Operating Temperature:-55℃~+155℃; LCSC Part Name: 470kΩ ±1% 62.5mW 厚膜电阻; Supplier Part: C25790; Manufacturer: UNI-ROYAL(厚声); Supplier Footprint: 0402; JLCPCB Part Class: Extended Part; Datasheet: https://item.szlcsc.com/datasheet/0402WGF4703TCE/26533.html; Supplier: LCSC; Type: Thick Film Resistor; Tolerance: ±1%; Power(Watts): 62.5mW; Voltage-Supply(Max): 50V; Temperature Coefficient: ±100ppm/℃; Operating Temperature: -55℃~+155℃
R3 = 0603WAF1003T5E: Type:Thick Film Resistor Resistance:100kΩ Tolerance:±1% Tolerance:±1% Power(Watts):100mW Voltage-Supply(Max):75V Temperature Coefficient:±100ppm/℃ Temperature Coefficient:±100ppm/℃ Operating Temperature:-55℃~+155℃ Operating Temperature:-55℃~+155℃; LCSC Part Name: 100kΩ ±1% 100mW 厚膜电阻; Supplier Part: C25803; Manufacturer: UNI-ROYAL(厚声); Supplier Footprint: 0603; JLCPCB Part Class: Basic Part; Datasheet: https://item.szlcsc.com/datasheet/0603WAF1003T5E/26546.html; Supplier: LCSC; Type: Thick Film Resistor; Tolerance: ±1%; Power(Watts): 100mW; Voltage-Supply(Max): 75V; Temperature Coefficient: ±100ppm/℃; Operating Temperature: -55℃~+155℃
R5 = 0402WGF1003TCE: Type:Thick Film Resistor Resistance:100kΩ Tolerance:±1% Tolerance:±1% Power(Watts):62.5mW Voltage-Supply(Max):50V Temperature Coefficient:±100ppm/℃ Temperature Coefficient:±100ppm/℃ Operating Temperature:-55℃~+155℃ Operating Temperature:-55℃~+155℃; LCSC Part Name: 100kΩ ±1% 62.5mW 厚膜电阻; Supplier Part: C25741; Manufacturer: UNI-ROYAL(厚声); Supplier Footprint: 0402; JLCPCB Part Class: Basic Part; Datasheet: https://item.szlcsc.com/datasheet/0402WGF1003TCE/26484.html; Supplier: LCSC; Type: Thick Film Resistor; Tolerance: ±1%; Power(Watts): 62.5mW; Voltage-Supply(Max): 50V; Temperature Coefficient: ±100ppm/℃; Operating Temperature: -55℃~+155℃
R6 R7 = 0402WGF5101TCE: Type:Thick Film Resistor Resistance:5.1kΩ Tolerance:±1% Tolerance:±1% Power(Watts):62.5mW Voltage-Supply(Max):50V Temperature Coefficient:±100ppm/℃ Temperature Coefficient:±100ppm/℃ Operating Temperature:-55℃~+155℃ Operating Temperature:-55℃~+155℃; LCSC Part Name: 5.1kΩ ±1% 62.5mW 厚膜电阻; Supplier Part: C25905; Manufacturer: UNI-ROYAL(厚声); Supplier Footprint: 0402; JLCPCB Part Class: Basic Part; Datasheet: https://item.szlcsc.com/datasheet/0402WGF5101TCE/26648.html; Supplier: LCSC; Type: Thick Film Resistor; Tolerance: ±1%; Power(Watts): 62.5mW; Voltage-Supply(Max): 50V; Temperature Coefficient: ±100ppm/℃; Operating Temperature: -55℃~+155℃
R8 R17 R24 R31 R33 R35 R37 R40 R52-R59 R63 = 0402WGF1002TCE: Type:Thick Film Resistor Resistance:10kΩ Tolerance:±1% Tolerance:±1% Power(Watts):62.5mW Voltage-Supply(Max):50V Temperature Coefficient:±100ppm/℃ Temperature Coefficient:±100ppm/℃ Operating Temperature:-55℃~+155℃ Operating Temperature:-55℃~+155℃; LCSC Part Name: 10kΩ ±1% 62.5mW 厚膜电阻; Supplier Part: C25744; Manufacturer: UNI-ROYAL(厚声); Supplier Footprint: 0402; JLCPCB Part Class: Basic Part; Datasheet: https://item.szlcsc.com/datasheet/0402WGF1002TCE/26487.html; Supplier: LCSC; Type: Thick Film Resistor; Tolerance: ±1%; Power(Watts): 62.5mW; Voltage-Supply(Max): 50V; Temperature Coefficient: ±100ppm/℃; Operating Temperature: -55℃~+155℃
R9 R27 = RC0402FR-071KL: Type:Thick Film Resistor Resistance:1kΩ Tolerance:±1% Tolerance:±1% Power(Watts):62.5mW Voltage-Supply(Max):50V Temperature Coefficient:±100ppm/℃ Temperature Coefficient:±100ppm/℃ Operating Temperature:-55℃~+155℃ Operating Temperature:-55℃~+155℃; LCSC Part Name: 厚膜电阻 1kΩ ±1% 62.5mW; Supplier Part: C106235; Manufacturer: YAGEO(国巨); Supplier Footprint: 0402; JLCPCB Part Class: Extended Part; Datasheet: https://item.szlcsc.com/datasheet/RC0402FR-071KL/107450.html; Supplier: LCSC; Type: Thick Film Resistor; Tolerance: ±1%; Power(Watts): 62.5mW; Voltage-Supply(Max): 50V; Temperature Coefficient: ±100ppm/℃; Operating Temperature: -55℃~+155℃
R10 = FRC0402F2212TS: Type:Thick Film Resistor Resistance:22.1kΩ Tolerance:±1% Tolerance:±1% Power(Watts):62.5mW Voltage-Supply(Max):50V Temperature Coefficient:±100ppm/℃ Temperature Coefficient:±100ppm/℃ Operating Temperature:-55℃~+155℃ Operating Temperature:-55℃~+155℃; LCSC Part Name: 22.1kΩ ±1% 62.5mW 厚膜电阻; Supplier Part: C2929993; Manufacturer: FOJAN(富捷); Supplier Footprint: 0402; JLCPCB Part Class: Extended Part; Datasheet: https://item.szlcsc.com/datasheet/FRC0402F2212TS/3266926.html; Supplier: LCSC; Type: Thick Film Resistor; Tolerance: ±1%; Power(Watts): 62.5mW; Voltage-Supply(Max): 50V; Temperature Coefficient: ±100ppm/℃; Operating Temperature: -55℃~+155℃
R11 = 0402WGF4752TCE: Type:Thick Film Resistor Resistance:47.5kΩ Tolerance:±1% Tolerance:±1% Power(Watts):62.5mW Voltage-Supply(Max):50V Temperature Coefficient:±100ppm/℃ Temperature Coefficient:±100ppm/℃ Operating Temperature:-55℃~+155℃ Operating Temperature:-55℃~+155℃; LCSC Part Name: 47.5kΩ ±1% 62.5mW 厚膜电阻; Supplier Part: C25896; Manufacturer: UNI-ROYAL(厚声); Supplier Footprint: 0402; JLCPCB Part Class: Extended Part; Datasheet: https://item.szlcsc.com/datasheet/0402WGF4752TCE/26639.html; Supplier: LCSC; Type: Thick Film Resistor; Tolerance: ±1%; Power(Watts): 62.5mW; Voltage-Supply(Max): 50V; Temperature Coefficient: ±100ppm/℃; Operating Temperature: -55℃~+155℃
R12 R13 R23 R34 R36 = RC0402FR-070RL: Type:Thick Film Resistors Resistance:0Ω Tolerance:±1% Tolerance:±1% Power(Watts):62.5mW Voltage-Supply(Max):50V Temperature Coefficient:- Temperature Coefficient:- Operating Temperature:-55℃~+155℃ Operating Temperature:-55℃~+155℃; LCSC Part Name: 厚膜电阻 0Ω ±1% 62.5mW; Supplier Part: C106231; Manufacturer: YAGEO(国巨); Supplier Footprint: 0402; JLCPCB Part Class: Extended Part; Datasheet: https://item.szlcsc.com/datasheet/RC0402FR-070RL/107446.html; Supplier: LCSC; Type: Thick Film Resistors; Tolerance: ±1%; Power(Watts): 62.5mW; Voltage-Supply(Max): 50V; Operating Temperature: -55℃~+155℃
R18 = 0402WGF1000TCE: Type:Thick Film Resistors Resistance: Tolerance:±1% Tolerance:±1% Power(Watts): Overload Voltage (Max): Temperature Coefficient:±200ppm/℃ Temperature Coefficient:±200ppm/℃ Operating Temperature Range:-55℃~+155℃ Operating Temperature Range:-55℃~+155℃; LCSC Part Name: 100Ω ±1% 62.5mW 厚膜电阻; Supplier Part: C25076; Manufacturer: UNI-ROYAL(厚声); Supplier Footprint: 0402; JLCPCB Part Class: Basic Part; Datasheet: https://atta.szlcsc.com/upload/public/pdf/source/20200306/C422600_1E6D84923E4A46A82E41ADD87F860B5C.pdf; Supplier: LCSC; Type: Thick Film Resistors; Tolerance: ±1%; Temperature Coefficient: ±200ppm/℃; Operating Temperature Range: -55℃~+155℃
R20-R22 = 0402WGF220JTCE: Type:Thick Film Resistors Resistance:22Ω Tolerance:±1% Tolerance:±1% Power(Watts): Overload Voltage (Max): Temperature Coefficient:±100ppm/℃ Temperature Coefficient:±100ppm/℃ Operating Temperature Range:-55℃~+155℃ Operating Temperature Range:-55℃~+155℃; LCSC Part Name: 22Ω ±1% 62.5mW 厚膜电阻; Supplier Part: C25092; Manufacturer: UNI-ROYAL(厚声); Supplier Footprint: 0402; JLCPCB Part Class: Basic Part; Datasheet: https://atta.szlcsc.com/upload/public/pdf/source/20200306/C422600_1E6D84923E4A46A82E41ADD87F860B5C.pdf; Supplier: LCSC; Type: Thick Film Resistors; Tolerance: ±1%; Temperature Coefficient: ±100ppm/℃; Operating Temperature Range: -55℃~+155℃
R28 = FRC0402F1200TS: Type:Thick Film Resistor Resistance:120Ω Tolerance:±1% Tolerance:±1% Power(Watts):62.5mW Voltage-Supply(Max):50V Temperature Coefficient:±100ppm/℃ Temperature Coefficient:±100ppm/℃ Operating Temperature:-55℃~+155℃ Operating Temperature:-55℃~+155℃; LCSC Part Name: 120Ω ±1% 62.5mW 厚膜电阻; Supplier Part: C2909315; Manufacturer: FOJAN(富捷); Supplier Footprint: 0402; JLCPCB Part Class: Extended Part; Datasheet: https://item.szlcsc.com/datasheet/FRC0402F1200TS/3186250.html; Supplier: LCSC; Type: Thick Film Resistor; Tolerance: ±1%; Power(Watts): 62.5mW; Voltage-Supply(Max): 50V; Temperature Coefficient: ±100ppm/℃; Operating Temperature: -55℃~+155℃
R30 = ERA2AEB6492X: Type:Thin Film Resistor Resistance:64.9kΩ Tolerance:±0.1% Tolerance:±0.1% Power(Watts):63mW Voltage-Supply(Max):50V Temperature Coefficient:±25ppm/℃ Temperature Coefficient:±25ppm/℃ Operating Temperature:-55℃~+155℃ Operating Temperature:-55℃~+155℃; LCSC Part Name: 64.9kΩ ±0.1% 63mW 薄膜电阻; Supplier Part: C490835; Manufacturer: PANASONIC(松下); Supplier Footprint: 0402; JLCPCB Part Class: Extended Part; Datasheet: https://item.szlcsc.com/datasheet/ERA2AEB6492X/501456.html; Supplier: LCSC; Type: Thin Film Resistor; Tolerance: ±0.1%; Power(Watts): 63mW; Voltage-Supply(Max): 50V; Temperature Coefficient: ±25ppm/℃; Operating Temperature: -55℃~+155℃
R32 = 0402WGJ010KTCE: Type:Thick Film Resistors Resistance:100mΩ Tolerance:±5% Tolerance:±5% Power(Watts):62.5mW Voltage-Supply(Max):50V Operating Temperature:-55℃~+155℃ Operating Temperature:-55℃~+155℃; LCSC Part Name: 100mΩ ±5% 62.5mW 厚膜电阻; Supplier Part: C474056; Manufacturer: UNI-ROYAL(厚声); Supplier Footprint: 0402; JLCPCB Part Class: Extended Part; Datasheet: https://item.szlcsc.com/datasheet/0402WGJ010KTCE/480589.html; Supplier: LCSC; Type: Thick Film Resistors; Tolerance: ±5%; Power(Watts): 62.5mW; Voltage-Supply(Max): 50V; Operating Temperature: -55℃~+155℃
R38 R39 R41 R44 R64 = RC0402FR-074K7L: Type:Thick Film Resistor Resistance:4.7kΩ Tolerance:±1% Tolerance:±1% Power(Watts):62.5mW Voltage-Supply(Max):50V Temperature Coefficient:±100ppm/℃ Temperature Coefficient:±100ppm/℃ Operating Temperature:-55℃~+155℃ Operating Temperature:-55℃~+155℃; LCSC Part Name: 厚膜电阻 4.7kΩ ±1% 62.5mW; Supplier Part: C105871; Manufacturer: YAGEO(国巨); Supplier Footprint: 0402; JLCPCB Part Class: Extended Part; Datasheet: https://item.szlcsc.com/datasheet/RC0402FR-074K7L/107086.html; Supplier: LCSC; Type: Thick Film Resistor; Tolerance: ±1%; Power(Watts): 62.5mW; Voltage-Supply(Max): 50V; Temperature Coefficient: ±100ppm/℃; Operating Temperature: -55℃~+155℃
R42 R45 = RC0402FR-0747KL: Type:Thick Film Resistor Resistance:47kΩ Tolerance:±1% Tolerance:±1% Power(Watts):62.5mW Voltage-Supply(Max):50V Temperature Coefficient:±100ppm/℃ Temperature Coefficient:±100ppm/℃ Operating Temperature:-55℃~+155℃ Operating Temperature:-55℃~+155℃; LCSC Part Name: 厚膜电阻 47kΩ ±1% 62.5mW; Supplier Part: C93943; Manufacturer: YAGEO(国巨); Supplier Footprint: 0402; JLCPCB Part Class: Extended Part; Datasheet: https://item.szlcsc.com/datasheet/RC0402FR-0747KL/95141.html; Supplier: LCSC; Type: Thick Film Resistor; Tolerance: ±1%; Power(Watts): 62.5mW; Voltage-Supply(Max): 50V; Temperature Coefficient: ±100ppm/℃; Operating Temperature: -55℃~+155℃
R43 R46 = RC0402FR-072K2L: Type:Thick Film Resistor Resistance:2.2kΩ Tolerance:±1% Tolerance:±1% Power(Watts):62.5mW Voltage-Supply(Max):50V Temperature Coefficient:±100ppm/℃ Temperature Coefficient:±100ppm/℃ Operating Temperature:-55℃~+155℃ Operating Temperature:-55℃~+155℃; LCSC Part Name: 厚膜电阻 2.2kΩ ±1% 62.5mW; Supplier Part: C114762; Manufacturer: YAGEO(国巨); Supplier Footprint: 0402; JLCPCB Part Class: Extended Part; Datasheet: https://item.szlcsc.com/datasheet/RC0402FR-072K2L/116006.html; Supplier: LCSC; Type: Thick Film Resistor; Tolerance: ±1%; Power(Watts): 62.5mW; Voltage-Supply(Max): 50V; Temperature Coefficient: ±100ppm/℃; Operating Temperature: -55℃~+155℃
R47 = RC0402FR-0710RL: Type:Thick Film Resistor Resistance:10Ω Tolerance:±1% Tolerance:±1% Power(Watts):62.5mW Voltage-Supply(Max):50V Temperature Coefficient:±200ppm/℃ Temperature Coefficient:±200ppm/℃ Operating Temperature:-55℃~+155℃ Operating Temperature:-55℃~+155℃; LCSC Part Name: 厚膜电阻 10Ω ±1% 62.5mW; Supplier Part: C138066; Manufacturer: YAGEO(国巨); Supplier Footprint: 0402; JLCPCB Part Class: Extended Part; Datasheet: https://item.szlcsc.com/datasheet/RC0402FR-0710RL/149382.html; Supplier: LCSC; Type: Thick Film Resistor; Tolerance: ±1%; Power(Watts): 62.5mW; Voltage-Supply(Max): 50V; Temperature Coefficient: ±200ppm/℃; Operating Temperature: -55℃~+155℃
R48 = RC0603FR-0727KL: Type:Thick Film Resistor Resistance:27kΩ Tolerance:±1% Tolerance:±1% Power(Watts):100mW Voltage-Supply(Max):75V Temperature Coefficient:±100ppm/℃ Temperature Coefficient:±100ppm/℃ Operating Temperature:-55℃~+155℃ Operating Temperature:-55℃~+155℃; LCSC Part Name: 厚膜电阻 27kΩ ±1% 100mW; Supplier Part: C114614; Manufacturer: YAGEO(国巨); Supplier Footprint: 0603; JLCPCB Part Class: Extended Part; Datasheet: https://item.szlcsc.com/datasheet/RC0603FR-0727KL/115858.html; Supplier: LCSC; Type: Thick Film Resistor; Tolerance: ±1%; Power(Watts): 100mW; Voltage-Supply(Max): 75V; Temperature Coefficient: ±100ppm/℃; Operating Temperature: -55℃~+155℃
R49-R51 R60-R62 = RC0402JR-070RL: Type:Thick Film Resistors Resistance: Tolerance:±5% Tolerance:±5% Power(Watts): Voltage-Supply(Max): Temperature Coefficient:- Temperature Coefficient:- Operating Temperature:-55℃~+155℃ Operating Temperature:-55℃~+155℃; LCSC Part Name: 厚膜电阻 0Ω ±5% 62.5mW; Supplier Part: C60485; Manufacturer: YAGEO(国巨); Supplier Footprint: 0402; JLCPCB Part Class: Extended Part; Datasheet: https://atta.szlcsc.com/upload/public/pdf/source/20170428/1493376821999.pdf; Supplier: LCSC; Type: Thick Film Resistors; Tolerance: ±5%; Operating Temperature: -55℃~+155℃
R65 = FRC0402F3300TS: Type:Thick Film Resistor Resistance:330Ω Tolerance:±1% Tolerance:±1% Power(Watts):62.5mW Voltage-Supply(Max):50V Temperature Coefficient:±100ppm/℃ Temperature Coefficient:±100ppm/℃ Operating Temperature:-55℃~+155℃ Operating Temperature:-55℃~+155℃; LCSC Part Name: 330Ω ±1% 62.5mW 厚膜电阻; Supplier Part: C2930002; Manufacturer: FOJAN(富捷); Supplier Footprint: 0402; JLCPCB Part Class: Extended Part; Supplier: LCSC; Type: Thick Film Resistor; Tolerance: ±1%; Power(Watts): 62.5mW; Voltage-Supply(Max): 50V; Temperature Coefficient: ±100ppm/℃; Operating Temperature: -55℃~+155℃
U1 = ESP32-S3-WROOM-1-N16R8: Utilized IC / Part:ESP32-S3R8 Interface Type:I2C；GPIO；UART；SPI；USB；I2S Frequency:2.4GHz Antenna Type:On-board PCB Antenna Output Power:20.5dBm Output Power:20.5dBm Voltage - Supply:3V~3.6V Voltage - Supply:3V~3.6V Receive  Current:95mA Send  Current:355mA; LCSC Part Name: 不带固件 通用型Wi-Fi+低功耗蓝牙MCU模组; Supplier Part: C2913202; Manufacturer: ESPRESSIF(乐鑫); Supplier Footprint: SMD,25.5x18mm; JLCPCB Part Class: Extended Part; Datasheet: https://item.szlcsc.com/datasheet/ESP32-S3-WROOM-1-N16R8/3198300.html; Supplier: LCSC; Utilized IC / Part: ESP32-S3R8; Interface Type: I2C；GPIO；UART；SPI；USB；I2S; Antenna Type: On-board PCB Antenna; Output Power: 20.5dBm; Voltage - Supply: 3V~3.6V; Receive  Current: 95mA; Send  Current: 355mA; Sensitivity: -103.5dBm; Operating Temperature: -40℃~+65℃
U2 = DS3231SN#T&R: Interface:I2C Voltage - Supply:2.3V~5.5V Voltage - Supply:2.3V~5.5V Operating Temperature:-40℃~+85℃ Operating Temperature:-40℃~+85℃; LCSC Part Name: 超高精度、I²C接口、集成RTC/TCXO/晶体; Supplier Part: C9866; Manufacturer: ADI(亚德诺)/MAXIM(美信); Supplier Footprint: SOIC-16-300mil; JLCPCB Part Class: Extended Part; Datasheet: https://item.szlcsc.com/datasheet/DS3231SN%2523T%2526R/10398.html; Supplier: LCSC; Interface: I2C; Voltage - Supply: 2.3V~5.5V; Operating Temperature: -40℃~+85℃
U3 = HT7333-A_C21583: Output Type:Fixed Voltage - Supply:12V Output Voltage:3.3V Output Voltage:3.3V Output Current:250mA Power Supply Rejection Ratio (PSRR):- Voltage Dropout:90mV@(40mA) standby current:3.5uA Operating Temperature:-40℃~+85℃@(Ta) Operating Temperature:-40℃~+85; LCSC Part Name: 输入12V 输出3.3V 250mA; Supplier Part: C21583; Manufacturer: HOLTEK(合泰/盛群); Supplier Footprint: SOT-89-3; JLCPCB Part Class: Extended Part; Supplier: LCSC; Output Type: Fixed; Voltage - Supply: 12V; Output Voltage: 3.3V; Output Current: 250mA; Voltage Dropout: 90mV@(40mA); standby current: 3.5uA; Operating Temperature: -40℃~+85℃@(Ta); Output Configuration: Positive; Number of Outputs: 1
U4 = AP63300WU-7: Function:Buck Voltage - Supply:3.8V~32V Voltage - Supply:3.8V~32V Output Voltage:800mV~31V Output Voltage:800mV~31V Output Current:3A Frequency - Switching:500kHz Frequency - Switching:500kHz Operating Temperature:-40℃~+125℃ Operating Temperature:-40℃~+12; LCSC Part Name: 3.8V至32V输入，3A低静态电流同步降压转换器，增强电磁干扰抑制; Supplier Part: C2158012; Manufacturer: DIODES(美台); Supplier Footprint: TSOT-23-6; JLCPCB Part Class: Extended Part; Datasheet: https://item.szlcsc.com/datasheet/AP63300WU-7/2250062.html; Supplier: LCSC; Function: Buck; Voltage - Supply: 3.8V~32V; Output Voltage: 800mV~31V; Output Current: 3A; Frequency - Switching: 500kHz; Operating Temperature: -40℃~+125℃; Synchronous Rectifier: Yes; Number of Outputs: 1; Topology: Buck; Quiescent Current: 22uA; Switch tube (built-in/external): Built-In; Output Type: Adjustable
U5 = CN3767: The Chip Type:Charging IC Voltage - Supply:6.6V~30V Voltage - Supply:6.6V~30V Charge Current - Max:4A Charging Saturation Voltage:14.8V End-Off Voltage:- Type of Battery:Lead-Acid Battery Number of Cells:- Number of Cells:- Operating Temperature:-40℃~+85℃; LCSC Part Name: 具有太阳能电池最大功率点跟踪功能的4A，12V铅酸电池充电管理集成电路; Supplier Part: C81968; Manufacturer: CONSONANCE(上海如韵); Supplier Footprint: SSOP-10-150mil; JLCPCB Part Class: Extended Part; Datasheet: https://item.szlcsc.com/datasheet/CN3767/83123.html; Supplier: LCSC; The Chip Type: Charging IC; Voltage - Supply: 6.6V~30V; Charge Current - Max: 4A; Charging Saturation Voltage: 14.8V; Type of Battery: Lead-Acid Battery; Operating Temperature: -40℃~+85℃; 0V Battery Charge: Not supported; Supply Current (Iq): 52uA
U6 = CP2102N-A02-GQFN28R: Applications Function:USB to UART USB Protocol:USB 2.0 Voltage - Supply:3V~3.6V Voltage - Supply:3V~3.6V Operating Temperature:-40℃~+85℃@(Ta) Operating Temperature:-40℃~+85℃@(Ta) Current - Supply:9.5mA Supply Current (Iq):1.3uA; Supplier Part: C964632; Manufacturer: SKYWORKS/SILICON LABS(芯科); Supplier Footprint: QFN-28-EP(5x5); JLCPCB Part Class: Extended Part; Datasheet: https://item.szlcsc.com/datasheet/CP2102N-A02-GQFN28R/1049893.html; Supplier: LCSC; Applications Function: USB to UART; USB Protocol: USB 2.0; Voltage - Supply: 3V~3.6V; Operating Temperature: -40℃~+85℃@(Ta); Current - Supply: 9.5mA; Supply Current (Iq): 1.3uA
U7 = EG800Q-EU
U9 = MAX-M10S-00B: Supplier Part: C4153167; Manufacturer: U-BLOX(优北罗); Supplier Footprint: LCC-18(9.7x10.1); JLCPCB Part Class: Extended Part; Datasheet: https://item.szlcsc.com/datasheet/MAX-M10S-00B/4722633.html; Supplier: LCSC
U10 = TLP291GB: Supplier Part: C2942904; Manufacturer: TOSHIBA(东芝); Supplier Footprint: SO-4-2.6mm; JLCPCB Part Class: Extended Part; Supplier: LCSC
USBC1 = TYPE-C-31-M-12: Connector Type:Type-C Protocol Standard:- Gender:Female Mounting Type:Surface Mount, Right Angle Number of Contacts:16P Number of Ports:1 Current Rating-Power:5A Voltage Rating:20V Connect-Disconnect Life:10,000 cycles Length:7.35mm Operating Temperature:; LCSC Part Name: Type-C 母 卧贴; Supplier Part: C165948; Manufacturer: 韩国韩荣; Supplier Footprint: SMD; JLCPCB Part Class: Extended Part; Datasheet: https://item.szlcsc.com/datasheet/TYPE-C-31-M-12/177331.html; Supplier: LCSC; Connector Type: Type-C; Gender: Female; Mounting Type: Surface Mount, Right Angle; Number of Contacts: 16P; Number of Ports: 1; Current Rating-Power: 5A; Voltage Rating: 20V; Connect-Disconnect Life: 10,000 cycles; Length: 7.35mm; Operating Temperature: -30℃~+80℃

## Nets
